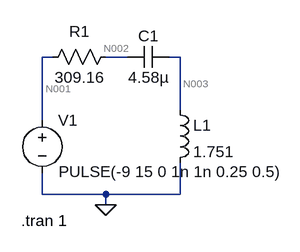
[diagram p0: schematic part2.asc]
part2.asc, the LTspice schematic file:
Version 4
SHEET 1 880 680
WIRE -256 -272 -272 -272
WIRE -144 -272 -176 -272
WIRE -64 -272 -80 -272
WIRE -64 -192 -64 -272
WIRE -272 -176 -272 -272
WIRE -272 -64 -272 -96
WIRE -176 -64 -272 -64
WIRE -64 -64 -64 -112
WIRE -64 -64 -176 -64
WIRE -176 -48 -176 -64
FLAG -176 -48 0
SYMBOL res -160 -288 R90
WINDOW 0 -7 56 VBottom 2
WINDOW 3 32 56 VTop 2
SYMATTR InstName R1
SYMATTR Value 309.16
SYMBOL voltage -272 -192 R0
WINDOW 3 25 94 Left 2
WINDOW 123 0 0 Left 0
WINDOW 39 0 0 Left 0
SYMATTR Value PULSE(-9 15 0 1n 1n 0.25 0.5)
SYMATTR InstName V1
SYMBOL ind -80 -208 R0
SYMATTR InstName L1
SYMATTR Value 1.751
SYMBOL cap -80 -288 R90
WINDOW 0 0 32 VBottom 2
WINDOW 3 32 32 VTop 2
SYMATTR InstName C1
SYMATTR Value 4.58µ
TEXT -304 -24 Left 2 !.tran 1

The netlist it stands for:
* part2.asc
R1 N002 N001 309.16
V1 N001 0 PULSE(-9 15 0 1n 1n 0.25 0.5)
L1 N003 0 1.751
C1 N003 N002 4.58µ
.tran 1
.backanno
.end

* Results of the author's LTspice run, read from the files saved beside the schematic
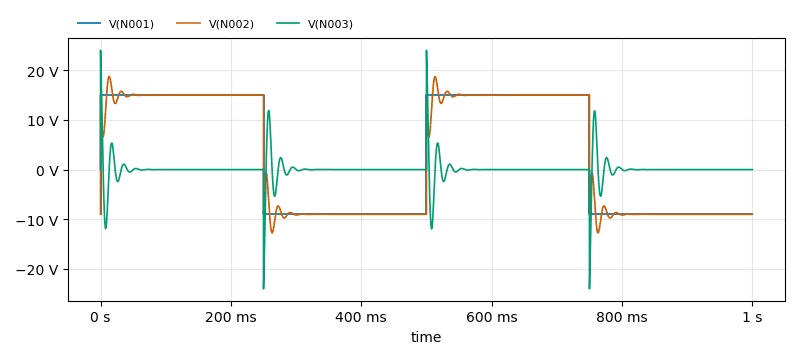
[diagram p1: Transient Analysis of part2.asc, plotted from the saved traces]
* Transient Analysis, 1 run:
*   V(N001): min -9 V, max 15 V, average 3 V, rms 12.37 V, last -9 V
*   V(N002): min -12.74 V, max 18.71 V, average 3 V, rms 12.3 V, last -9 V
*   V(N003): min -24 V, max 24 V, average 318.7 µV, rms 2.552 V, last 0 V